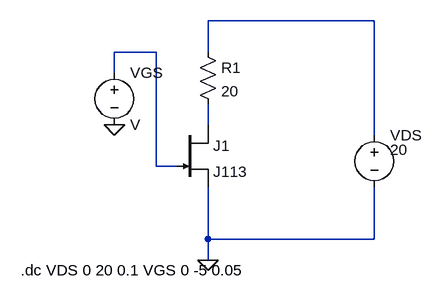
[diagram p0: schematic j113_swee[.asc]
j113_swee[.asc, the LTspice schematic file:
Version 4
SHEET 1 880 680
WIRE 656 80 400 80
WIRE 320 128 256 128
WIRE 400 128 400 80
WIRE 256 160 256 128
WIRE 400 240 400 208
WIRE 656 256 656 80
WIRE 320 304 320 128
WIRE 352 304 320 304
WIRE 400 416 400 336
WIRE 656 416 656 336
WIRE 656 416 400 416
WIRE 400 448 400 416
FLAG 400 448 0
FLAG 256 240 0
SYMBOL njf 352 240 R0
SYMATTR InstName J1
SYMATTR Value J113
SYMBOL Voltage 656 240 R0
WINDOW 3 24 38 Left 2
SYMATTR InstName VDS
SYMATTR Value 20
SYMBOL Res 384 112 R0
SYMATTR InstName R1
SYMATTR Value 20
SYMBOL Voltage 256 144 R0
SYMATTR InstName VGS
TEXT 112 464 Left 2 !.dc VDS 0 20 0.1 VGS 0 -5 0.05

The netlist it stands for:
* j113_swee[.asc
J1 N003 N002 0 J113
VDS N001 0 20
R1 N001 N003 20
VGS N002 0 V
.model NJF NJF
.model PJF PJF
.lib standard.jft
.dc VDS 0 20 0.1 VGS 0 -5 0.05
.backanno
.end